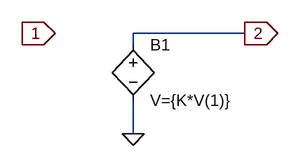
[diagram p0: schematic gain.asc]
gain.asc, the LTspice schematic file:
Version 4
SHEET 1 880 680
WIRE 400 128 240 128
WIRE 240 144 240 128
WIRE 240 272 240 224
FLAG 128 128 1
IOPIN 128 128 In
FLAG 240 272 0
FLAG 400 128 2
IOPIN 400 128 Out
SYMBOL bv 240 128 R0
SYMATTR InstName B1
SYMATTR Value V={K*V(1)}

The netlist it stands for:
* gain.asc
B1 2 0 V={K*V(1)}
.backanno
.end